# EasyEDA Pro project STM32F722.eprj, board PCB1
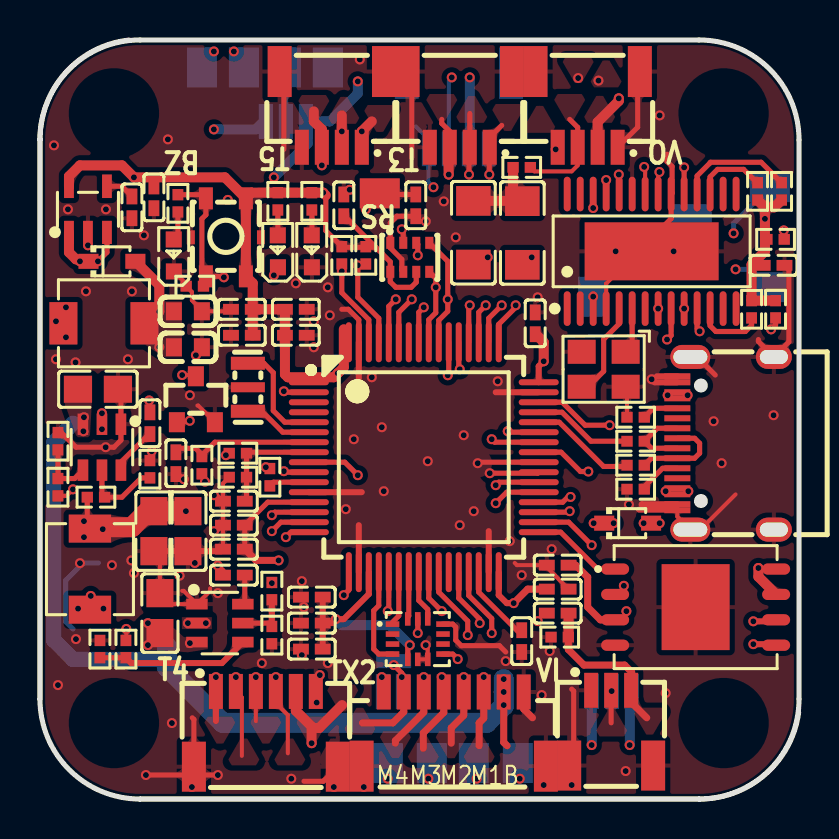
[diagram p1: board, top side]
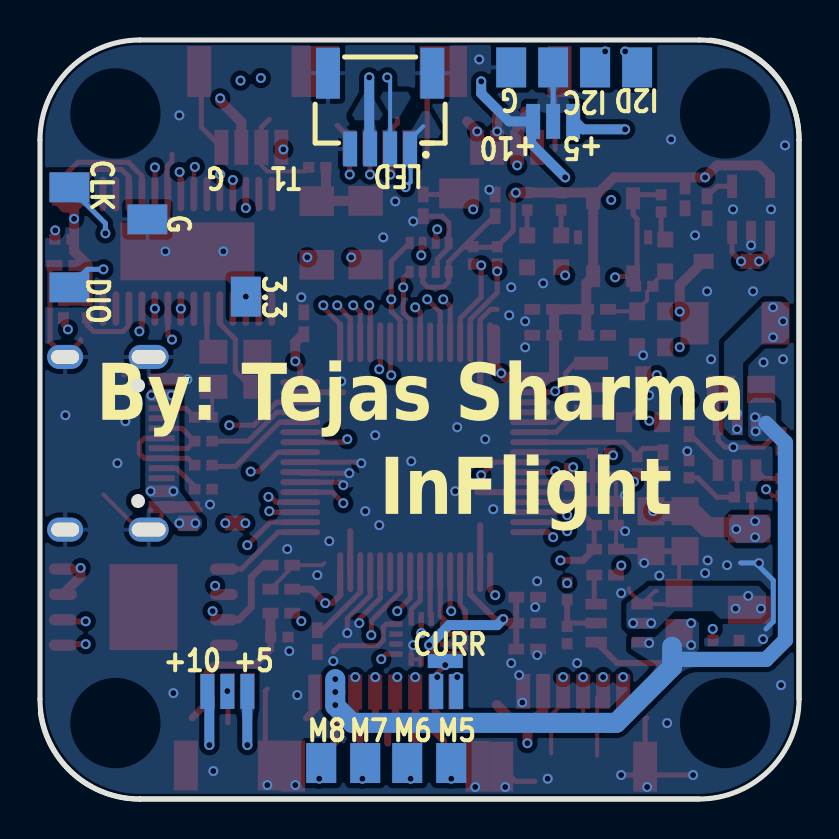
[diagram p2: board, bottom side, seen from below]

Outline 37.97 x 37.97 mm; copper layers: Top Layer, 内层1, MidLayer2, Bottom Layer. Coordinates in mm from the lower left corner of the outline.
Outline path: 4.45,37.97 arc(1.27,36.33) 0,33 0,5 ; 0,5 0,32.97 arc(1.46,36.51) 5,37.97 32.97,37.97 arc(36.51,36.51) 37.97,32.97 37.97,5 arc(36.51,1.46) 32.97,0 5,0 ; 0,5 arc(1.46,1.46) 5,0 ; 5,0 33,0 arc(36.29,1.23) 37.95,4.32
Stack: Top Layer 0.035mm / Dielectric1 1.51mm FR4 er 4.5 / 内层1 0.035mm / Dielectric2 0.48mm PP er 4.5 / MidLayer2 0.035mm / Dielectric3 0.48mm PP er 4.5 / Bottom Layer 0.035mm

## Design rules (mm)
template: 自定义配置
spacing copperThickness1oz (default): track to track 0.102, other pairs 0.152 to 0.3
spacing copperThickness2oz: track to track 0.203, other pairs 0.152 to 0.3
track width copperThickness1oz (default): min 0.127, default 0.254, max 2.54
track width copperThickness2oz: min 0.203, default 0.254, max 2.54
differential pair differentialPair (default): width min 0.127, default 0.254, max 2.54; gap min 0.152, default 0.152
via viaSize (default): diameter min 0.5, default 0.61, max 10; hole min 0.3, default 0.305, max 6.3

## Placement (name value [footprint] x y rotation side)
C13  2.2uF  [C0402]  24.1 7.9 90 top
C14  100nF  [C0402]  6.8 16.8 90 top
C27  1uF  [C0402]  5.7 30.1 90 top
C31  100nF  [C0402]  25.9 9.3 0 top
C33  100nF  [C0402]  12.8 23.2 180 top
C34  10nF  [C0402]  10.1 23.2 0 top
C35  10uF  [C0402]  12.8 24.5 180 top
C37  1uF  [C0402]  10.1 24.5 0 top
C39  100nF  [C0402]  9.7 13.7 0 top
C42  1uF  [C0402]  9.7 12.5 0 top
C43  22uF  [C0805]  6 9.3 90 top
C44  100nF  [C0402]  9.7 11.2 0 top
C51  100nF  [C0402]  5.5 18.8 270 top
C52  22uF  [C0603]  7.4 24.4 180 top
C53  22uF  [C0603]  7.4 22.6 180 top
C54  22uF  [C0805]  2.9 20.5 0 top
C55  22uF  [C0805]  7.4 13.4 90 top
C56  22uF  [C0805]  5.7 13.4 90 top
C57  100nF  [C0402]  13.6 10.1 0 top
C58  100nF  [C0402]  25.9 10.5 180 top
C59  100nF  [C0402]  13.6 7.5 0 top
C60  100nF  [C0402]  24.77 23.8 270 top
C61  100nF  [C0402]  15.2 29.7 270 top
C62  100nF  [C0402]  13.6 8.8 0 top
C63  100nF  [C0402]  25.9 11.7 0 top
C64  100nF  [C0402]  36.7 26.7 180 top
C65  47uF  [C1206]  21.68 28.33 90 top
C66  47uF  [C1206]  24.13 28.32 90 top
C67  100nF  [C0402]  9.7 14.9 0 top
C68  1uF  [C0402]  4.6 29.6 90 top
C69  100nF  [C0402]  18.8 29.7 270 top
CN11  1.0-6PWT  [CONN-SMD_1.0-6PWT]  11.3 3.5 0 top
CN12  HC-1.0-4PWT  [CONN-SMD_4P-P1.00_HCTL_HC-1.0-4PWT]  27.4 34.5 180 top
CN15  HC-1.0-4PWT  [CONN-SMD_4P-P1.00_HCTL_HC-1.0-4PWT]  14.6 34.5 180 top
CN17  HC-1.0-4PWT  [CONN-SMD_4P-P1.00_HCTL_HC-1.0-4PWT]  21 34.5 180 top
CN18  HC-1.0-8PWT  [CONN-SMD_HC-1.0-8PWT]  20.7 3.5 0 top
CN19  1.0-3PWT  [CONN-SMD_1.0-3PWT]  28.57 3.56 0 top
CN21  HC-1.0-4PWT  [CONN-SMD_4P-P1.00_HCTL_HC-1.0-4PWT]  20.96 34.42 0 bottom
D1  1N5819WS  [SOD-323_L1.8-W1.3-LS2.5-RD]  3.6 26.9 0 top
D2  1N5819WS  [SOD-323_L1.8-W1.3-LS2.5-RD]  29.4 13.8 0 top
L2  10uH  [IND-SMD_L4.4-W4.2]  2.5 11.5 270 top
L3  10uH  [IND-SMD_L4.4-W4.2]  3.2 23.8 180 top
LED1  NCD0603B1  [LED0603-RD]  11.9 27.4 90 top
LED3  NCD0603R1  [LED0603-RD_RED]  13.6 27.4 90 top
LED4  NCD0603B1  [LED0603-RD]  6.69 27.19 90 top
NOREF  -  [Pad_e20081]  23.9 1.8 0 top
NOREF#2  -  [Pad_e19975]  19.6 1.8 0 top
NOREF#3  -  [Pad_e19538]  17.15 5.38 0 top
NOREF#4  -  [Pad_e19974]  17.4 1.8 0 top
NOREF#5  -  [Pad_e20483]  36.5 25.6 90 top
NOREF#6  -  [Pad_e20388]  27.68 25.13 180 top
NOREF#7  -  [Pad_e19905]  12.3 36.6 0 top
NOREF#8  -  [Pad_e19811]  17.7 6.9 90 top
NOREF#9  -  [Pad_e19936]  11.3 33.9 0 top
NOREF#10  -  [Pad_e20532]  10.2 36.6 0 top
NOREF#11  -  [Pad_e19906]  14.4 36.6 0 top
NOREF#12  -  [Pad_e19526]  17 30.3 270 top
NOREF#13  -  [Pad_e20121]  29.6 5.38 0 top
NOREF#14  -  [Pad_e20484]  36.5 30.6 90 top
NOREF#15  -  [Pad_e19939]  12.3 33.9 0 top
NOREF#16  -  [Pad_e20122]  28.6 5.38 0 top
NOREF#17  -  [Pad_e20370]  32.6 29 90 top
NOREF#18  -  [Pad_e20531]  8.1 36.6 0 top
NOREF#19  -  [Pad_e19937]  13.3 33.9 0 top
NOREF#20  -  [Pad_e19539]  18.15 5.38 0 top
NOREF#21  -  [Pad_e19976]  21.7 1.8 0 top
NOREF#22  -  [Pad_e20120]  27.6 5.38 0 top
Q1  S8050LT1-J3Y  [SOT-23_L2.9-W1.3-P1.90-LS2.4-BR]  7.8 20 270 top
R14  1kΩ  [R0402]  35.6 24.5 270 top
R24  1kΩ  [R0402]  9.9 16.1 0 top
R25  10kΩ  [R0402]  9.9 17.3 180 top
R26  330Ω  [R0402]  13.6 29.9 270 top
R28  330Ω  [R0402]  11.9 29.9 270 top
R29  330Ω  [R0402]  6.9 29.8 270 top
R30  10kΩ  [R0402]  8.1 16.7 270 top
R31  1kΩ  [R0402]  15.1 27.2 270 top
R32  1kΩ  [R0402]  16.3 27.2 270 top
R33  ICM-42688-P  [LGA-14_L3.0-W2.5-P0.50-TL]  18.9 8 0 top
R34  5.1kΩ  [R0402]  29.8 15.5 0 top
R35  5.1kΩ  [R0402]  29.8 19.1 180 top
R36  22Ω  [R0402]  29.8 16.7 0 top
R37  22Ω  [R0402]  29.8 17.9 0 top
R38  10kΩ  [R0402]  36.8 24.5 270 top
R39  10kΩ  [R0402]  36.8 28 180 top
R40  1kΩ  [R0402]  37.1 30.4 270 top
R41  1kΩ  [R0402]  35.9 30.4 270 top
R43  75Ω  [R0402]  26 8.1 0 top
R44  200kΩ  [R0402]  4.3 7.5 90 top
R45  13.3kΩ  [R0402]  3 7.5 270 top
R48  20kΩ  [R0402]  11.6 8.2 270 top
R49  56kΩ  [R0402]  11.6 10.4 90 top
R50  100kΩ  [R0402]  0.9 15.6 270 top
R51  13.3kΩ  [R0402]  0.9 17.9 270 top
R52  20kΩ  [R0402]  5.5 16.5 90 top
R53  56kΩ  [R0402]  2.8 15.1 180 top
R54  75Ω  [R0402]  24.1 31.6 0 top
R55  1kΩ  [R0402]  11.5 16.1 90 top
R56  10kΩ  [R0402]  7.75 25.65 0 top
U4  STM32F722RET6  [LQFP-64_L10.0-W10.0-P0.50-LS12.0-BL]  19.2 17.1 270 top
U5  BMP280  [LGA-8_L2.5-W2.0-P0.65_AMP6127]  18.5 27.1 90 top
U13  TS3315A 160gf 025  [SW-SMD_4P-L3.4-W3.4-P2.00-LS4.0_TS3315A160GF]  9.3 28.1 90 top
U20  AT7456E  [TSSOP-28_L9.7-W4.4-P0.65-LS6.4-BL-EP-2]  30.6 27.4 0 top
U21  W25N01GVZEIG  [wson-8_l8.0-w6.10-p1.27-bl-ep]  32.8 9.6 270 top
U22  SPX3819M5-L-3-3/TR  [SOT-23-5_L3.0-W1.7-P0.95-LS2.8-BL]  2.4 29.5 0 top
U26  TPS54302DDCR  [SOT-23-6_L2.9-W1.6-P0.95-LS2.8-BL]  9 8.8 270 top
U27  TPS54302DDCR  [SOT-23-6_L2.9-W1.6-P0.95-LS2.8-BL]  3.1 17.6 180 top
USB2  KH-TYPE-C-16P  [USB-C-SMD_KH-TYPE-C-16P]  34.3 17.8 90 top
X1  8MHz  [OSC-SMD_3P-L3.2-W1.3-P1.2-L]  10.4 20.6 270 top
X2  27MHz  [OSC-SMD_4P-L3.2-W2.5-BL]  28.2 21.5 180 top

## Footprints (pads in the part's own frame, mm; a bottom-side part is the same pattern mirrored in y, then rotated)
C0402
  rect 0.79x0.54 smd: 1(-0.545,0) 2(0.545,0)
C0603
  rect 0.8x0.9 smd: 1(-0.7,0) 2(0.7,0)
C0805
  rect 1.41x1.35 smd: 1(-1,0) 2(1,0)
C1206
  rect 1.485x1.728 smd: 1(-1.593,0) 2(1.593,0)
CONN-SMD_1.0-3PWT
  rect 0.7x1.75 smd: 1(-1,1.883) 2(0,1.883) 3(1,1.883)
  rect 1.2x2.5 smd: 4(-2.1,-1.883) 5(2.1,-1.883)
CONN-SMD_1.0-6PWT
  rect 0.7x1.75 smd: 1(-2.5,1.883) 2(-1.5,1.883) 3(-0.5,1.883) 4(0.5,1.883) 5(1.5,1.883) 6(2.5,1.883)
  rect 1.2x2.5 smd: 7(-3.6,-1.883) 8(3.6,-1.883)
CONN-SMD_4P-P1.00_HCTL_HC-1.0-4PWT
  rect 0.7x1.75 smd: 1(-1.5,1.895) 2(-0.5,1.895) 3(0.5,1.895) 4(1.5,1.895)
  rect 1.2x2.55 smd: 5(2.61,-1.895) 6(-2.61,-1.895)
CONN-SMD_HC-1.0-8PWT
  rect 0.7x1.75 smd: 1(-3.5,1.855) 2(-2.5,1.855) 3(-1.5,1.855) 4(-0.5,1.855) 5(0.5,1.855) 6(1.5,1.855) 7(2.499,1.855) 8(3.499,1.855)
  rect 1.2x2.55 smd: 9(4.61,-1.855) 10(-4.61,-1.855)
IND-SMD_L4.4-W4.2
  rect 1.4x2.12 smd: 1(2.028,0) 2(-2.028,0)
LED0603-RD
  rect 0.8x0.8 smd: 1(-0.799,-0.004) 2(0.799,0.004)
LED0603-RD_RED
  rect 0.8x0.8 smd: 1(-0.799,-0.004) 2(0.799,0.004)
LGA-8_L2.5-W2.0-P0.65_AMP6127
  rect 0.6x0.4 smd: 1(0.725,0.975) 2(0.725,0.325) 3(0.725,-0.325) 4(0.725,-0.975) 5(-0.725,-0.975) 6(-0.725,-0.325) 7(-0.725,0.325) 8(-0.725,0.975)
LGA-14_L3.0-W2.5-P0.50-TL
  rect 0.675x0.28 smd: 1(-1.262,0.75) 2(-1.262,0.25) 3(-1.262,-0.25) 4(-1.262,-0.75) 8(1.262,-0.75) 9(1.262,-0.25) 10(1.262,0.25) 11(1.262,0.75)
  rect 0.28x0.675 smd: 5(-0.5,-1.012) 6(0,-1.012) 7(0.5,-1.012) 12(0.5,1.012) 13(0,1.012) 14(-0.5,1.012)
LQFP-64_L10.0-W10.0-P0.50-LS12.0-BL
  oval 0.3x2 smd: 1(-3.75,-5.75) 2(-3.25,-5.75) 3(-2.75,-5.75) 4(-2.25,-5.75) 5(-1.75,-5.75) 6(-1.25,-5.75) 7(-0.75,-5.75) 8(-0.25,-5.75) 9(0.25,-5.75) 10(0.75,-5.75) 11(1.25,-5.75) 12(1.75,-5.75) 13(2.25,-5.75) 14(2.75,-5.75) 15(3.25,-5.75) 16(3.75,-5.75) 33(3.75,5.75) 34(3.25,5.75) 35(2.75,5.75) 36(2.25,5.75) 37(1.75,5.75) 38(1.25,5.75) 39(0.75,5.75) 40(0.25,5.75) 41(-0.25,5.75) 42(-0.75,5.75) 43(-1.25,5.75) 44(-1.75,5.75) 45(-2.25,5.75) 46(-2.75,5.75) 47(-3.25,5.75) 48(-3.75,5.75)
  oval 2x0.3 smd: 17(5.75,-3.75) 18(5.75,-3.25) 19(5.75,-2.75) 20(5.75,-2.25) 21(5.75,-1.75) 22(5.75,-1.25) 23(5.75,-0.75) 24(5.75,-0.25) 25(5.75,0.25) 26(5.75,0.75) 27(5.75,1.25) 28(5.75,1.75) 29(5.75,2.25) 30(5.75,2.75) 31(5.75,3.25) 32(5.75,3.75) 49(-5.75,3.75) 50(-5.75,3.25) 51(-5.75,2.75) 52(-5.75,2.25) 53(-5.75,1.75) 54(-5.75,1.25) 55(-5.75,0.75) 56(-5.75,0.25) 57(-5.75,-0.25) 58(-5.75,-0.75) 59(-5.75,-1.25) 60(-5.75,-1.75) 61(-5.75,-2.25) 62(-5.75,-2.75) 63(-5.75,-3.25) 64(-5.75,-3.75)
OSC-SMD_3P-L3.2-W1.3-P1.2-L
  rect 0.65x1.7 smd: 1(-1.2,0) 3(1.2,0)
  rect 0.5x1.7 smd: 2(0,0)
OSC-SMD_4P-L3.2-W2.5-BL
  rect 1.4x1.2 smd: 1(-1.1,-0.875) 2(1.1,-0.875) 3(1.1,0.875) 4(-1.1,0.875)
Pad_e19526
  rect 1.5x2 smd: 76(0,0)
Pad_e19538
  rect 0.7x1.75 smd far side: 24(0,0)
Pad_e19539
  rect 0.7x1.75 smd far side: 78(0,0)
Pad_e19811
  rect 0.7x1.75 smd far side: 79(0,0)
Pad_e19905
  rect 1.5x2 smd far side: 76(0,0)
Pad_e19906
  rect 1.5x2 smd far side: 76(0,0)
Pad_e19936
  rect 0.7x1.75 smd far side: 70(0,0)
Pad_e19937
  rect 0.7x1.75 smd far side: 70(0,0)
Pad_e19939
  rect 0.7x1.75 smd far side: 70(0,0)
Pad_e19974
  rect 1.5x2 smd far side: 74(0,0)
Pad_e19975
  rect 1.5x2 smd far side: 75(0,0)
Pad_e19976
  rect 1.5x2 smd far side: 76(0,0)
Pad_e20081
  rect 1.5x2 smd far side: 77(0,0)
Pad_e20120
  rect 0.7x1.75 smd far side: 71(0,0)
Pad_e20121
  rect 0.7x1.75 smd far side: 73(0,0)
Pad_e20122
  rect 0.7x1.75 smd far side: 72(0,0)
Pad_e20370
  rect 1.5x2 smd far side: 76(0,0)
Pad_e20388
  rect 1.5x2 smd far side: 76(0,0)
Pad_e20483
  rect 1.5x2 smd far side: 76(0,0)
Pad_e20484
  rect 1.5x2 smd far side: 76(0,0)
Pad_e20531
  rect 1.5x2 smd far side: 76(0,0)
Pad_e20532
  rect 1.5x2 smd far side: 76(0,0)
R0402
  rect 0.566x0.54 smd: 1(-0.433,0) 2(0.433,0)
SOD-323_L1.8-W1.3-LS2.5-RD
  rect 1x0.75 smd: 1(-1.173,0) 2(1.173,0)
SOT-23-5_L3.0-W1.7-P0.95-LS2.8-BL
  rect 0.49x1.157 smd: 1(-0.95,-1.153) 2(0,-1.153) 3(0.95,-1.153)
  rect 0.49x1.175 smd: 4(0.95,1.153) 5(-0.95,1.153)
SOT-23-6_L2.9-W1.6-P0.95-LS2.8-BL
  rect 0.532x1.072 smd: 1(-0.95,-1.149) 2(0,-1.149) 3(0.95,-1.149) 4(0.95,1.149) 5(0,1.149) 6(-0.95,1.149)
SOT-23_L2.9-W1.3-P1.90-LS2.4-BR
  rect 1x0.8 smd: 1(1.15,-0.95) 2(1.15,0.95) 3(-1.15,0)
SW-SMD_4P-L3.4-W3.4-P2.00-LS4.0_TS3315A160GF
  rect 1.1x0.7 smd: 1(-1.95,1) 2(1.95,1) 3(-1.95,-1) 4(1.95,-1)
  rect 0.7x0.4 smd: 5(0,1.755) 5(0,-1.755)
TSSOP-28_L9.7-W4.4-P0.65-LS6.4-BL-EP-2
  oval 0.343x1.732 smd: 1(-4.225,-2.866) 2(-3.575,-2.866) 3(-2.925,-2.866) 4(-2.275,-2.866) 5(-1.625,-2.866) 6(-0.975,-2.866) 7(-0.325,-2.866) 8(0.325,-2.866) 9(0.975,-2.866) 10(1.625,-2.866) 11(2.275,-2.866) 12(2.925,-2.866) 13(3.575,-2.866) 14(4.225,-2.866) 15(4.225,2.866) 16(3.575,2.866) 17(2.925,2.866) 18(2.275,2.866) 19(1.625,2.866) 20(0.975,2.866) 21(0.325,2.866) 22(-0.325,2.866) 23(-0.975,2.866) 24(-1.625,2.866) 25(-2.275,2.866) 26(-2.925,2.866) 27(-3.575,2.866) 28(-4.225,2.866)
  rect 6.7x2.9 smd: 29(0,0)
USB-C-SMD_KH-TYPE-C-16P
  oval 1.2x2 hole 0.7x1.7: 1(-4.32,1.765) 2(4.32,1.765)
  oval 1.2x1.8 hole 0.7x1.4: 3(-4.32,-2.415) 4(4.32,-2.415)
  rect 0.3x1.3 smd: A1(-3.35,2.415) A4(-2.55,2.415) A5(-1.25,2.415) A6(-0.25,2.415) A7(0.25,2.415) A8(1.25,2.415) A9(2.55,2.415) A12(3.35,2.415) B1(3.05,2.415) B4(2.25,2.415) B5(1.75,2.415) B6(0.75,2.415) B7(-0.75,2.415) B8(-1.75,2.415) B9(-2.25,2.415) B12(-3.05,2.415)
wson-8_l8.0-w6.10-p1.27-bl-ep
  oval 0.56x1.4 smd: 1(-1.905,-4.027) 2(-0.635,-4.027) 3(0.635,-4.027) 4(1.905,-4.027) 5(1.905,4.027) 6(0.635,4.027) 7(-0.635,4.027) 8(-1.905,4.027)
  rect 4.3x3.4 smd: 9(0,0)

## Nets
As in the schematic, except:
+3.3V_1: C27.2 C33.2 C34.2 C35.2 C37.2 C39.2 C42.2 C57.2 C58.2 C59.2 C60.2 C61.2 C62.2 C63.2 C64.2 NOREF#6.76 R14.1 R26.1 R28.1 R30.2 R31.1 R32.1 R33.5 R33.8 R38.1 R39.2 R40.2 R41.2 U4.1 U4.13 U4.19 U4.32 U4.48 U4.64 U5.6 U5.8 U13.3 U13.4 U20.3 U20.21 U20.24 U21.3 U21.7 U21.8 U22.5
+5V: CN11.5 CN15.3 CN17.3 CN21.3 D1.1 D2.1 NOREF#9.70 NOREF#22.71 U22.1 U22.3
+10V: C55.2 C56.2 CN12.2 L2.2 NOREF#13.73 NOREF#19.70 R44.2 R53.2
AGND: C13.1 C14.1 C27.1 C33.1 C34.1 C35.1 C37.1 C39.1 C42.1 C43.2 C52.1 C53.1 C54.2 C55.1 C56.1 C57.1 C58.1 C59.1 C60.1 C61.1 C62.1 C63.1 C64.1 C67.1 C68.1 C69.2 CN11.6 CN11.7 CN11.8 CN12.1 CN12.5 CN12.6 CN15.4 CN15.5 CN15.6 CN17.4 CN17.5 CN17.6 CN18.8 CN18.9 CN18.10 CN19.1 CN19.4 CN19.5 CN21.4 CN21.5 CN21.6 LED3.1 LED4.1 NOREF#11.76 NOREF#17.76 Q1.2 R24.1 R33.6 R33.7 R33.11 R34.1 R35.2 R43.1 R45.1 R48.2 R51.1 R52.2 R56.1 U4.12 U4.18 U4.31 U4.47 U4.63 U5.1 U5.7 U13.5 U20.4 U20.20 U20.23 U20.29 U21.4 U21.9 U22.2 U26.1 U27.1 USB2.1 USB2.2 USB2.3 USB2.4 USB2.A1 USB2.A12 USB2.B1 USB2.B12 X1.2 X2.2 X2.4
ADC_CURR: CN18.2 NOREF#8.79 NOREF#20.78 U4.9
I2C_SCL: NOREF#10.76 R32.2 U4.61
I2C_SDA: NOREF#18.76 R31.2 U4.62
MOTOR5: NOREF#4.74 U4.40
MOTOR6: NOREF#2.75 U4.39
MOTOR7: NOREF#21.76 U4.38
MOTOR8: NOREF.77 U4.37
RAM1: CN19.2 NOREF#16.72
RAM5: CN18.1 NOREF#3.24
RAM6: NOREF#7.76 NOREF#15.70
RSSI: C69.1 NOREF#12.76 U4.10
SWCLK: NOREF#14.76 U4.49
SWDIO: NOREF#5.76 U4.46

Pads without a net: R33 2 3 9 10; U4 27 58; U20 1 2 7 13 14 15 16 27 28; USB2 A8 B8

## Via types
v1: diameter 0.5, hole 0.3, Top Layer to Bottom Layer, 238 vias

## Routing (per net, layer and track width the routed paths; a pad name or vN(x,y) marks a point on that pad's centre or on a via; arc(x,y) is an arc through that point)
+3.3V_1: length 188.4
  Top Layer w0.2: v1(28.96,31.24) 28.97,31.22 U20.24 ; v1(30.99,31.37) 30.93,31.31 U20.21 ; v1(8.25,15.88) 8.25,16.11 R30.2
  Top Layer w0.254: U5.6 18.82,25.85 18.57,25.6 17.8,25.6 17.53,25.88 U5.8 17.53,26.88 16.8,27.6 ; 16.8,27.6 15.13,27.6 14.3,28.43 14.3,30.2 ; 16.8,27.6 15.25,29.16 C61.2 ; U4.13 11.4,14.85 C39.2 C42.2 ; v1(18.5,7.7) 18.4,7.6 R33.5 ; v1(20.9,7) 20.65,7.25 R33.8
  Top Layer w0.3: C62.2 C59.2 ; C62.2 C57.2 ; C62.2 14.6,8.8 v1(14.8,9) 15.2,9 16.45,10.25 U4.19 ; v1(25.2,21.9) 24.95,21.65 U4.48 ; v1(23.7,9.8) 23.35,9.8 22.95,10.2 U4.32
  Top Layer w0.35: v1(11.94,11.94) 10.81,11.94 C42.2 ; C63.2 26.8,11.7 27.4,11.1 27.4,9.6 28.03,8.97 29.27,8.97 ; C58.2 24.4,10.5 v1(23.7,9.8)
  Top Layer w0.5: C37.2 C34.2 ; C37.2 10.65,25.81 U13.3 U13.4 ; C37.2 C35.2 C33.2 12.25,21.25 12.4,21.1 14.7,21.1 v1(14.9,21.3) 15.2,21.6 15.2,23.5 ; R38.1 R14.1 35.6,26.73 36.27,27.4 v1(36.27,29.03) 36.27,29.6 ; 36.27,29.6 R41.2 ; 36.27,29.6 36.73,29.6 R40.2 ; U13.4 10.58,30.33 v1(14.17,30.33) 14.3,30.2 ; U13.4 9.25,31.1 v1(4.7,31.1) 4.1,31.7 2,31.7 1.45,31.15 U22.5 ; 24.8,23.25 25.2,22.86 v1(25.2,21.9) ; U21.7 35.94,11.12 v1(35.94,11.56)
  内层1 w0.35: v1(8.25,15.88) 9.4,15.88 10.16,15.11 12.45,15.11 13.46,14.1 13.46,12.7 12.7,11.94 v1(11.94,11.94)
  内层1 w0.5: 29.08,29.08 26.4,26.4 ; 29.08,29.08 30.99,30.99 v1(30.99,31.37) ; 29.08,29.08 29.08,31.11 v1(28.96,31.24) ; 26.4,26.4 26.41,26.4 v1(27.68,25.13) ; 26.4,26.4 18.1,26.4 v1(14.17,30.33) ; v1(29.34,9.4) 29.5,9.4 31.66,11.56 v1(35.94,11.56) ; v1(14.9,21.3) 16.1,20.1 23.4,20.1 v1(25.2,21.9)
  MidLayer2 w0.254: 14.5,16.62 14.08,16.2 14.08,14.08 v1(11.94,11.94)
  MidLayer2 w0.5: v1(18.5,7.7) 18.5,7.3 18.8,7 v1(20.9,7) 22.4,7 23.7,8.3 v1(23.7,9.8) ; v1(14.9,21.3) 14.5,20.9 14.5,9.3 v1(14.8,9) ; v1(35.94,11.56) 35.3,12.2 35.3,25.8 36.27,26.77 v1(36.27,29.03) 35.32,29.97 32.38,29.97 v1(30.99,31.37)
  Bottom Layer w0.5: v1(14.8,9) 15.1,8.7 17.5,8.7 v1(18.5,7.7)
+5V: length 114.3
  Top Layer w0.254: CN17.3 20.5,33.4 20.1,33.8 20.1,34 ; D1.1 v1(2.9,26.9) 3.35,27.35 U22.3
  Top Layer w0.5: v1(20.45,31.24) 20.45,32.55 CN17.3 ; 13.72,3.56 13.97,3.56 15.11,4.7 ; 13.7,34.4 13.7,33.9 14.1,33.5 CN15.3 ; D1.1 2.33,27 1.8,27 1.45,27.35 U22.1 ; CN11.5 12.8,4.42 13.59,3.63 v1(13.59,2.79)
  内层1 w0.5: 23.2,34 23.2,34 v1(20.45,31.24) 19.94,31.75 14.15,31.75 v1(14.1,31.7) 12.3,33.5 v1(8.7,33.5) 8.7,30.3 5.3,26.9 ; 23.2,34 26,34 v1(27.94,35.94) ; 23.2,34 21.5,35.7 v1(21.5,36.1) ; v1(27.6,2.7) 27.6,11.2 28.7,12.3 v1(28.7,13.8) 28.7,17 26.35,19.35 14.35,19.35 6.8,26.9 5.3,26.9 ; 5.3,26.9 v1(2.9,26.9)
  MidLayer2 w0.5: v1(13.59,2.79) 13.68,2.7 v1(27.6,2.7)
  Bottom Layer w0.5: v1(27.6,2.7) 27.6,5.18 ; v1(21.5,36.1) 21.5,32.62 ; v1(8.7,33.5) 10.8,33.5 11.2,33.9
  vias: v1(2,26.9) v1(27.7,13.8)
+10V: length 102.7
  Top Layer w0.2: v1(4.32,8.51) 4.32,7.95 R44.2
  Top Layer w0.254: R53.2 2.37,13.66 L2.2
  Top Layer w0.5: CN12.2 27.9,33.87 28.96,34.92 v1(28.96,35.05)
  Top Layer w1: L2.2 2.57,13.6 4.6,13.6 5.4,14.4 C56.2 C55.2
  内层1 w0.254: v1(4.32,8.51) 4.32,8.62 6.2,10.5 6.2,13.3 v1(7.3,14.4)
  MidLayer2 w0.5: v1(15.9,35.9) 17.1,37.1 28.05,37.1 28.96,36.19 v1(28.96,35.05) ; v1(29.5,2.7) 28.75,1.95 9.95,1.95 5.2,6.7 1.7,6.7 0.8,7.6 0.8,12.5 1.8,13.5 v1(3.14,13.5) 3.58,13.5 8.5,18.42 8.5,27.9 v1(11.7,31.1)
  Bottom Layer w0.5: 29.6,5.18 29.5,5.08 v1(29.5,2.7) ; v1(15.9,35.9) 15.9,35.3 14.5,33.9 13.4,33.9 13.4,32.8 v1(11.7,31.1)
  vias: v1(2.2,13.9) v1(2.2,13.1)
AGND: length 114
  Top Layer w0.2: v1(5.59,17.4) 5.5,17.31 R52.2 ; U26.1 8.51,10.41 8.51,10.54 ; U26.1 7.19,10.41 7.11,10.41 ; U26.1 6.55,9.75 C43.2 6,12.1 C56.1 ; v1(8.7,15.2) 8.85,15.2 C67.1 ; C42.1 C39.1 ; C39.1 8.85,13.4 v1(8.7,13.4) ; C39.1 C67.1 ; U20.4 28.32,25.78 28.32,25.78 29.94,27.4 U20.29 ; LED4.1 7.31,25.78 R56.1 7.6,25.37 7.6,24.95 8.1,24.45 C52.1 9.46,24.4 C37.1 ; R33.6 R33.7 19.4,7.6 v1(19.3,7.7) ; C67.1 9.16,15.79 R24.1 ; Q1.2 7.91,19.69 7.87,19.69 ; C58.1 25.78,11.16 25.78,11.18 25.35,11.6 C63.1 23.86,11.7 23.75,11.81 ; v1(7.2,16) 6.94,16.25 C14.1 ; 31.88,14.75 31.88,14.13 USB2.1 33.04,13.48 34.8,15.24 ; R35.2 29.37,20.56 X2.4
  Top Layer w0.254: U20.29 30.6,28.06 31.57,29.03 U20.20 31.62,30.31 31.62,31.64 31.37,31.9 31.37,32.26 ; 13.21,0.89 14.17,0.89 CN11.8 ; C69.2 17.85,29.16 17.53,28.83 U5.1 17.53,27.58 18.1,27 18.1,26.45 U5.7 ; 35.94,22.99 35.94,22.89 USB2.4 37.47,22.87 37.47,26.48 C64.1 ; C54.2 4.05,20.35 U27.1 4.05,17.95 3.7,17.6 v1(3.29,17.6) 1.8,17.6 1.07,18.33 0.9,18.33 ; CN15.5 12.2,36.18 12.2,32.5 ; CN12.6 29.9,36.28 29.9,33.61 CN12.1 ; CN11.7 7.7,3.98 7.62,4.06 ; 33.78,21.21 32.87,22.12 USB2.2 ; v1(8.9,1.2) v1(5.3,1.2) ; 23.3,7.36 22.98,7.67 21.08,7.67 20.8,7.95 20.8,8.6 20.65,8.75 R33.11 ; 18.6,32.1 18.6,36.18 CN17.5 ; 26.5,1.62 26.7,1.82 26.7,5.4 26.6,5.5 ; 15.1,24.5 15.43,24.5 15.95,23.98 U4.63
  Top Layer w0.3: 31.88,20.85 30.75,20.85 v1(30.6,21) ; 30.1,14.73 30.11,14.75 31.88,14.75 ; C42.1 9.06,12.4 C55.1 C56.1 ; U4.47 22.8,20.35 ; U4.18 15.95,13.7 ; U4.31 22.45,13.4 ; U4.63 15.95,20.6 ; 29.97,14.48 31.85,14.48 31.88,14.45 ; U4.12 16.1,15.35 ; 31.88,21.15 30.86,21.15
  Top Layer w0.35: 24.64,4.06 24.2,4.5 CN18.8
  Bottom Layer w0.254: 1.65,8.51 1.29,8.87 1.29,10.94 2.16,11.81 2.92,11.81
  vias: v1(0.7,32.7) v1(0.8,22) v1(0.9,5.7) v1(1.4,29.5) v1(1.78,21.84) v1(1.8,8) v1(2,11.8) v1(2.3,25.4) v1(2.4,27.7) v1(3.3,29.5) v1(3.6,11.7) v1(4.4,22) v1(4.6,25.4) v1(4.57,11.94) v1(4.7,11.3) v1(5.2,28.2) v1(6.4,33) v1(6.6,3.8) v1(6.99,11.18) v1(7.5,20.2) v1(7.6,0.6) v1(7.75,11.81) v1(7.8,22.2) v1(8.9,10.3) v1(11.1,6.8) v1(12.57,1.02) v1(12.8,25.8) v1(13.1,10.9) v1(13.1,7.2) v1(13.2,9.6) v1(13.7,23.9) v1(13.7,22.6) v1(13.84,4.83) v1(14,6.2) v1(14.4,25.6) v1(14.4,6.8) v1(14.5,24.2) v1(14.7,0.6) v1(15.3,14.5) v1(15.49,30.48) v1(15.7,18) v1(16,37) v1(16.2,0.6) v1(16.6,21.1) v1(17.1,18.6) v1(17.2,15.4) v1(19.3,28.9) v1(19.4,16.9) v1(20.2,29.9) v1(20.8,28.1) v1(21,13.7) v1(21.2,18.2) v1(21.7,14.4) v1(22.9,20.9) v1(23.3,6.9) v1(23.5,12.9) v1(24.1,11.2) v1(24.9,25.1) v1(25.1,5.2) v1(25.2,0.7) v1(25.5,7.4) v1(25.6,12.5) v1(26.6,0.7) v1(28.8,27.4) v1(29.3,1.4) v1(29.46,14.73) v1(31,34.2) v1(31.3,5.3) v1(31.7,27.4) v1(33.7,18.9) v1(34.1,16.8) v1(36.7,19.2)
VBAT: length 53.3
  Top Layer w0.35: v1(23.2,5.36) v1(23.2,4.7) 23.2,2.84 23.37,2.67
  MidLayer2 w0.254: 8.25,7.75 8.55,7.75 v1(11.6,10.8) 10.66,10.8 9.3,12.16 v1(9.3,17.2)
  Bottom Layer w0.762: 1.65,18.8 0.68,17.83 0.68,7.96 1.65,6.99 6.35,6.99
  Bottom Layer w1: v1(23.2,6) v1(23.2,5.36) 23.2,4.66 22.35,3.81 9.14,3.81 6.35,6.6 6.35,7.62
  vias: v1(2.2,19.1) v1(2.17,18.4) v1(5.4,8.8) v1(5.4,7.7) v1(7.5,7.8)
VBUS:
  vias: v1(30.2,13.8) v1(31,13.8) v1(31.3,15.4) v1(31.4,20.2) v1(32.4,20.2) v1(32.44,15.4)
VIN: length 26.4
  Top Layer w0.2: U20.22 30.28,31.57 v1(30.23,31.62)
  MidLayer2 w0.4: v1(24.9,8.9) 24.9,18.3 27.2,20.6 27.2,22.3 30.3,25.4 30.3,31.55 v1(30.23,31.62)
ADC_BATT: length 5.6
  Top Layer w0.254: C67.2 10.33,14.99 R24.2 R25.1 10.38,17.35 U4.8
ADC_CURR: length 17
  Top Layer w0.254: U4.9 15.25,16.85 v1(15.9,16.2) ; v1(18.1,6.1) 18.1,6.3 v1(17.7,6.7)
  Top Layer w0.35: 16.13,3.81 17.65,3.81 18.2,4.36 CN18.2
  MidLayer2 w0.254: v1(17.7,6.7) 15.9,8.5 v1(15.9,16.2)
BARO_CS: length 6.8
  Top Layer w0.254: v1(18.1,28.5) 18.18,28.42 U5.2 ; v1(18.6,25) 17.95,24.35 U4.59
  MidLayer2 w0.254: v1(18.1,28.5) 18.1,27.1 18.6,26.6 v1(18.6,25)
BEEPER: length 2
  Top Layer w0.254: U4.11 11.68,15.85 11.5,15.67
BOOT0: length 17.8
  Top Layer w0.254: R29.1 8.12,30.23 U13.2 8.3,29.23 8.1,29.03 8.1,26.35 U13.1 9.15,26.15 v1(9.2,26.1) ; v1(17.8,25) 17.45,24.65 U4.60
  内层1 w0.254: v1(17.8,25) 10.3,25 v1(9.2,26.1)
FLASH_CS: length 4.6
  Top Layer w0.254: U4.33 26.05,13.35 27.9,11.5 28.8,11.5
GYRO_CS: length 2.4
  Top Layer w0.254: U4.24 18.95,9.94 19.4,9.48 19.4,9.11
GYRO_EXTI1: length 5
  Top Layer w0.254: R33.4 16.95,7.25 16.7,7.5 16.7,9.42 16.95,9.68 U4.20
I2C_SCL: length 18.7
  Top Layer w0.254: U4.61 16.95,24.05 15.9,25.1 v1(15.9,26.7) 16.23,26.7 R32.2
  MidLayer2 w0.254: v1(9.7,37.4) 9.7,36.9 13.5,33.1 13.5,27.9 14.38,27.02 15.58,27.02 v1(15.9,26.7)
I2C_SDA: length 18.5
  Top Layer w0.254: R31.2 v1(15.1,26.4) 15.1,25.33 16.45,23.98 U4.62
  MidLayer2 w0.254: v1(15.1,26.4) 14.5,26.4 13.1,27.8 13.1,32.9 8.7,37.3 v1(8.7,37.4)
LED1: length 7.3
  Top Layer w0.254: U4.2 12.25,20.35 v1(12.2,20.4)
  MidLayer2 w0.254: v1(12.2,20.4) 11.7,20.9 v1(11.7,26.2)
LED_SIRIP: length 18.2
  Top Layer w0.254: v1(23.1,24.7) 22.45,24.05 U4.50
  MidLayer2 w0.254: v1(23.1,24.7) 23.03,24.77 23.03,31.57 20.6,34 v1(20.6,36.1)
  Bottom Layer w0.2: CN21.2 20.46,35.95 v1(20.6,36.1)
LOS: length 3.5
  Top Layer w0.254: U20.12 33.53,23.67 33.81,23.39 35.29,23.39 35.6,23.7 R14.2
MOTOR1: length 8.7
  Top Layer w0.254: U4.29 21.45,10.18 22.6,9.03 v1(22.6,8.3)
  Top Layer w0.35: CN18.6 22.2,4.04 21.97,3.81 21.97,2.67
  内层1 w0.254: v1(22.2,6.1) 22.2,6.2 22.6,6.6 v1(22.6,8.3)
MOTOR2: length 8.8
  Top Layer w0.254: v1(22,8.8) 22,9 20.95,10.05 U4.28
  Top Layer w0.35: 20.57,2.79 20.57,3.56 21.2,4.18 CN18.5
  内层1 w0.254: v1(22,8.8) 22,7.1 21.2,6.3 v1(21.2,6.1)
MOTOR3: length 9.8
  Top Layer w0.254: U4.26 19.95,10.35 21.4,8.9 v1(21.4,8.2)
  Top Layer w0.35: 19.18,2.54 19.18,3.3 20.2,4.33 CN18.4
  内层1 w0.254: v1(20.1,6.1) 20.1,7.2 21.1,8.2 v1(21.4,8.2)
MOTOR4: length 9
  Top Layer w0.254: U4.25 19.45,10.05 v1(20.1,9.4)
  Top Layer w0.35: CN18.3 19.2,4.34 17.78,2.92 17.78,2.79
  内层1 w0.254: v1(19.2,6.1) 19.2,6.85 20.1,7.75 v1(20.1,9.4)
MOTOR5: length 21.8
  Top Layer w0.254: v1(21.9,16.8) 21.95,16.85 U4.40
  内层1 w0.254: v1(17.4,1.02) 17.4,2.41 16.13,3.68 16.13,10.54 21.9,16.31 v1(21.9,16.8)
MOTOR6: length 21.4
  Top Layer w0.254: U4.39 24.9,16.3 v1(22.5,16.3)
  内层1 w0.254: v1(19.43,1.02) 16.57,3.88 16.57,10.22 22.5,16.15 v1(22.5,16.3)
MOTOR7: length 18.7
  Top Layer w0.254: U4.38 22.95,15.85 v1(22.8,15.7)
  内层1 w0.254: v1(21.84,1.02) 21.97,1.02 23.9,2.94 23.9,8.2 22.27,9.83 22.27,15.17 v1(22.8,15.7)
MOTOR8: length 17
  Top Layer w0.254: U4.37 23.35,15.35 v1(22.8,14.8)
  内层1 w0.254: v1(24,1.02) 24,2.41 24.3,2.71 24.3,8.35 22.73,9.92 22.73,14.73 v1(22.8,14.8)
NRST: length 6.9
  Top Layer w0.254: 6.9,17.55 7.79,17.55 8.1,17.23 8.13,17.23 8.75,17.85 U4.7
OSD_CS: length 20
  Top Layer w0.254: U4.41 26.07,17.35 27.04,16.38 v1(27.43,16.38) ; R38.2 36.8,23.72 v1(36.58,23.5)
  内层1 w0.254: v1(30.93,24.53) 31.79,25.4 34.67,25.4 v1(36.58,23.5)
  MidLayer2 w0.254: v1(30.93,24.53) 30.83,24.53 27.9,21.6 27.9,16.85 v1(27.43,16.38)
RAM1: length 1.6
  Top Layer w0.254: 28.57,3.81 28.57,5.38 v1(28.6,5.4)
RAM5:
  vias: v1(17.1,6.1)
RAM6: length 2.7
  Bottom Layer w0.254: NOREF#15.70 NOREF#7.76
RSSI: length 18.1
  Top Layer w0.254: 17,30.1 17.15,30.25 C69.1 ; v1(12.2,16.4) 12.25,16.35 U4.10
  MidLayer2 w0.254: v1(16.3,29.5) 16.5,29.3 16.5,23.7 12.2,19.4 v1(12.2,16.4)
RX1: length 20.7
  Top Layer w0.254: v1(23.4,18.4) 23.45,18.35 U4.43
  MidLayer2 w0.254: v1(26.92,36.07) 26.6,35.74 26.6,21.7 23.4,18.5 v1(23.4,18.4)
RX2: length 10.1
  Top Layer w0.2: 12.4,2.29 12.4,4.2 11.8,4.8 CN11.4
  Top Layer w0.254: U4.17 15.45,10.45 v1(15.2,10.2)
  内层1 w0.254: v1(11.8,6.1) 11.8,6.75 15.2,10.15 v1(15.2,10.2)
RX3: length 11.5
  Top Layer w0.254: U4.52 21.45,24.65 v1(21.5,24.7) ; v1(21.46,31.24) 21.46,32.57 CN17.2 21.5,34.3
  MidLayer2 w0.254: v1(21.46,31.24) 21.46,24.74 v1(21.5,24.7)
RX4: length 13.4
  Top Layer w0.2: 10.1,2.16 10.1,5.08 CN11.2
  Top Layer w0.254: U4.15 12.05,13.85 v1(11.6,13.4)
  内层1 w0.254: v1(11.6,13.4) 10.04,11.84 10.04,6.34 v1(9.8,6.1)
RX5: length 18.4
  Top Layer w0.254: U4.54 20.45,21.25 v1(20.4,21.2)
  Top Layer w0.5: 15.1,34.2 v1(15.1,33.4) CN15.2
  MidLayer2 w0.254: v1(15.1,33.4) 15.24,33.4 16.9,31.74 16.9,23.56 19.26,21.2 v1(20.4,21.2)
SAG: length 7.5
  内层1 w0.5: v1(28.32,30.97) 27.54,30.97 23.68,27.1 v1(22.4,27.1)
SPI_MISO1: length 2.6
  Top Layer w0.254: 17.64,8.85 17.95,9.16 U4.22
SPI_MISO2: length 7
  Top Layer w0.254: v1(26.5,14.4) 26.45,14.35 U4.35
  MidLayer2 w0.254: v1(26.5,14.4) 26.5,12.36 28.19,10.67 v1(29.21,10.67)
SPI_MISO3: length 19.7
  Top Layer w0.254: v1(33,23.4) 32.88,23.53 U20.11 ; U4.56 19.45,23.98 19.8,24.33 v1(19.8,25.6) 19.8,26.05 U5.5
  内层1 w0.254: v1(33,23.4) 32.8,23.6 20.7,23.6 19.8,24.5 v1(19.8,25.6)
SPI_MOSI1: length 2.3
  Top Layer w0.254: 18.4,9.11 18.45,9.16 U4.23
SPI_MOSI2: length 16.8
  Top Layer w0.254: U4.36 26.15,14.85 26.41,15.11 v1(26.54,15.11)
  Top Layer w0.3: v1(35.69,7.75) 36.78,7.75 U21.5
  MidLayer2 w0.254: v1(35.69,7.75) 35.05,8.38 35.05,9.27 32.26,12.06 27.43,12.06 27.03,12.47 27.03,14.63 v1(26.54,15.11)
SPI_MOSI3: length 19.8
  Top Layer w0.254: v1(18.9,27.2) 18.9,27.75 U5.3 ; v1(19.2,24.6) 18.95,24.35 U4.57 ; U20.9 31.57,23.19 v1(31.37,22.99)
  内层1 w0.254: v1(19.2,24.6) 19.2,24.37 20.47,23.1 31.26,23.1 v1(31.37,22.99)
  MidLayer2 w0.254: v1(18.9,27.2) 19.2,26.9 v1(19.2,24.6)
SPI_SCK1: length 4.7
  Top Layer w0.254: v1(18.9,8.3) 18.9,9.11 ; U4.21 17.45,9.45 v1(17.4,9.4)
  内层1 w0.254: v1(18.9,8.3) 18.5,8.3 v1(17.4,9.4)
SPI_SCK2: length 14.2
  Top Layer w0.254: U4.34 26.45,13.85 v1(27.6,12.7)
  Top Layer w0.3: v1(35.69,8.89) 36.75,8.89 U21.6
  MidLayer2 w0.254: v1(27.6,12.7) 27.69,12.7 27.94,12.45 32.55,12.45 35.69,9.31 v1(35.69,8.89)
SPI_SCK3: length 18.2
  Top Layer w0.254: U5.4 20.4,26.9 v1(20.4,25) 20.4,24.4 19.95,23.95 U4.55
  内层1 w0.254: 32.1,24.5 31.6,24 20.84,24 20.4,24.44 v1(20.4,25)
  vias: v1(32.22,24.53)
SWCLK: length 17.9
  Top Layer w0.254: U4.49 22.95,23.75 23.8,24.6 v1(23.8,24.7)
  内层1 w0.254: v1(23.8,24.7) 24.1,24.4 29.9,24.4 33.8,28.3 v1(34.7,28.3)
  Bottom Layer w0.254: NOREF#14.76 34.7,28.8 v1(34.7,28.3)
SWDIO: length 18.7
  Top Layer w0.254: U4.46 26.12,19.85 27.27,18.7 v1(28.5,18.7)
  MidLayer2 w0.254: v1(28.5,18.7) 32.2,18.7 34,20.5 34,25.7 v1(34.8,26.5)
  Bottom Layer w0.254: NOREF#5.76 35.6,26.5 v1(34.8,26.5)
TX1: length 18.6
  Top Layer w0.254: U4.42 22.75,17.85 v1(22.6,18)
  MidLayer2 w0.254: v1(22.6,18) 22.6,18.36 26.2,21.96 26.2,32.1 v1(25.8,32.5)
TX2: length 10.6
  Top Layer w0.2: CN11.3 10.8,3.9
  Top Layer w0.254: U4.16 12.55,13.35 v1(12.3,13.1)
  内层1 w0.254: v1(12.3,13.1) 10.5,11.3 10.5,6.4 v1(10.8,6.1)
TX3: length 11.8
  Top Layer w0.254: v1(22.48,31.24) 22.48,33.08 23.1,33.7 ; v1(22.3,24.7) 21.95,24.35 U4.51
  MidLayer2 w0.254: v1(22.48,31.24) 22.34,31.24 21.87,30.77 21.87,25.13 v1(22.3,24.7)
TX4: length 12.7
  Top Layer w0.254: v1(11.6,14.2) 11.75,14.35 U4.14
  Top Layer w0.3: CN11.1 8.8,3.9
  内层1 w0.254: v1(8.8,6.1) 9.6,6.9 9.6,12.15 11.6,14.15 v1(11.6,14.2)
TX5: length 17.7
  Top Layer w0.254: U4.53 20.95,21.55 v1(21,21.5)
  Top Layer w0.5: 16.6,33.9 v1(16.1,33.4) CN15.1
  MidLayer2 w0.254: v1(16.1,33.4) 16.1,33.04 17.27,31.87 17.27,23.69 19.21,21.75 20.75,21.75 v1(21,21.5)
USB_DM: length 5.4
  Top Layer w0.254: R36.1 29.3,16.64 28.19,16.64 25.98,18.85 U4.44
USB_DP: length 5
  Top Layer w0.254: R37.1 27.57,17.9 26.12,19.35 U4.45
VOUT: length 4.1
  内层1 w0.5: v1(27.68,29.57) 27.07,29.57 v1(24.6,27.1)
$1N5315: length 4.2
  Top Layer w0.254: 24.1,8.44 24.1,8.3 24.05,8.25 21.95,10.35 U4.30
$1N6274: length 1.3
  Top Layer w0.254: 13.6,28.15 13.6,29.46 R26.2
$1N6277: length 1.3
  Top Layer w0.254: 11.91,28.15 11.9,28.15 R28.2
$1N6597: length 1.6
  Top Layer w0.254: 6.9,29.37 6.9,27.99 LED4.2
$1N6740: length 5.6
  Top Layer w0.254: U4.5 12.25,18.85 11.67,19.43 11.67,21.33 11.2,21.8 10.2,21.8
$1N6754: length 3.7
  Top Layer w0.254: U4.6 12.15,18.35 11.1,19.4 10.2,19.4
$1N8449: length 1.8
  Top Layer w0.254: R35.1 30.68,19.55 31.88,19.55
$1N8452: length 2.2
  Top Layer w0.254: 31.88,16.55 31.15,16.55 30.23,15.63 R34.2
$1N8750: length 4.7
  Top Layer w0.254: R36.2 30.58,17.05 32.75,17.05 33,17.3 33,17.8 32.75,18.05 31.88,18.05
$1N8765: length 3.7
  Top Layer w0.254: 31.88,18.55 30.88,18.55 R37.2 30.59,17.55 31.88,17.55
$1N15437: length 2.1
  Top Layer w0.254: U20.6 29.62,22.9 29.3,22.58
$1N15438: length 4.9
  Top Layer w0.254: X2.3 27.43,20.62 28.2,21.4 28.2,23 28.97,23.78 U20.5
$1N15463: length 8.1
  Top Layer w0.2: v1(37.21,28.45) 37.23,28.43 R39.1
  Top Layer w0.254: U20.19 v1(32.22,31.6)
  内层1 w0.254: v1(32.22,31.6) 32.6,31.6 35.75,28.45 v1(37.21,28.45)
$1N15464: length 3.7
  Top Layer w0.254: 35.9,30.83 35.87,30.83 35.2,31.5 33.9,31.5 33.53,31.12 U20.17
$1N15465: length 5.8
  Top Layer w0.254: U20.18 32.88,31.17 33.5,31.8 33.54,31.86 36.08,31.86 37.1,30.83
$1N15786: length 8.1
  Top Layer w0.35: 30.35,4.06 29.6,4.82 29.6,6.35 29.25,6.7 27.21,6.7 26.43,7.48 R43.2
  Top Layer w0.5: R43.2 26.44,8.11 C31.2
$1N34361: length 4.1
  Top Layer w0.254: C44.1 9.16,11.42 v1(8.89,11.68)
  MidLayer2 w0.254: v1(8.89,11.68) 7.4,10.19 v1(7.4,8.8)
  vias: v1(1.91,9.53) v1(2.54,10.16) v1(3.18,9.53) v1(8.3,8.8)
$1N34362: length 1.5
  Top Layer w0.254: C44.2 10.25,9.85 U26.6
$1N34400: length 7.7
  Top Layer w0.254: R45.2 R44.1
  Top Layer w0.3: R44.1 4.57,6.8 9.1,6.8 10.15,7.85
$1N34492: length 2.9
  Top Layer w0.254: 11.6,8.63 11.43,8.8 U26.5
  Top Layer w0.3: 11.6,8.63 R49.1
$1N34966: length 13.6
  Top Layer w0.2: 0.9,15.17 1.32,15.17 v1(1.65,15.49)
  Top Layer w0.5: v1(5.97,24.38) 5.97,25.7 D1.2
  内层1 w0.254: v1(1.65,15.49) 2.89,15.49 6.1,18.7 6.1,22.48 v1(5.97,22.61)
$1N34973: length 3.2
  Top Layer w0.2: v1(5.46,19.94) 5.5,19.9 C51.1
  MidLayer2 w0.254: v1(3.1,19.3) 3.1,19.3 4.83,19.3 v1(5.46,19.94)
  vias: v1(0.8,23.9) v1(1.3,24.6) v1(1.3,23.1) v1(3.1,18.5)
$1N34978: length 2.4
  Top Layer w0.254: U27.6 4.05,16.85 5.46,18.25
$1N34984: length 2.9
  Top Layer w0.254: U27.4 1.73,16.03 R50.1 R51.2
$1N34994: length 4.1
  Top Layer w0.254: R52.1 5.07,16.07 4.1,15.1 R53.1 3.1,15.23 U27.5
$1N42503: length 4.3
  Top Layer w0.5: 24.12,29.92 23.67,30.37 R54.1 ; 24.12,29.92 C66.2 ; 24.12,29.92 C65.2
$1N42504: length 5
  Top Layer w0.2: R54.2 24.73,31.4 26.6,31.4 26.9,31.7 CN12.3
  Top Layer w0.254: 26.5,34 26.9,33.6 CN12.3
$1N48463: length 1.5
  Top Layer w0.254: U22.4 4.09,30.65 C68.2
$1N67638: length 5.4
  Top Layer w0.2: Q1.1 7.42,18.85 v1(7.49,18.92)
  内层1 w0.254: v1(11.3,16.6) 8.98,18.92 v1(7.49,18.92)
$1N67645: length 24.7
  Top Layer w0.2: v1(7.11,21.21) 7.74,21.21 Q1.3
  内层1 w0.2: v1(19.69,30.61) 19.3,30.99 13.34,30.99 12.32,29.97 v1(9.4,29.97)
  MidLayer2 w0.254: v1(9.4,29.97) 9.4,29.8 7.2,27.6 7.2,21.3 v1(7.11,21.21)
  Bottom Layer w0.2: 19.43,32.5 19.43,33.02 18.8,33.66 ; 19.43,32.5 19.43,30.86 v1(19.69,30.61) ; 19.43,32.5 CN21.1

## Copper pours and planes (outline as drawn; the poured copper is in the pictures)
+5V on Top Layer: 12.93,35.22 14.47,35.22 14.47,33.87 12.93,33.87
+5V on Top Layer: 14.37,5.73 15.92,5.73 15.92,4.38 14.37,4.38
+5V on Top Layer: 27.55,36.95 29.09,36.95 29.09,35.6 27.55,35.6
+5V on Top Layer: 12.83,4.12 14.37,4.12 14.37,2.77 12.83,2.77
+5V on Top Layer: 19.33,35.27 20.87,35.27 20.87,33.92 19.33,33.92
+5V on Bottom Layer: 20.82,35.3 22.36,35.3 22.36,33.95 20.82,33.95
+5V on 内层1: 27.6,14.3 28.8,14.3 28.8,13.4 27.6,13.4
+10V on Top Layer: 27.23,35.18 28.77,35.18 28.77,33.83 27.23,33.83
+10V on Bottom Layer: 1.4,14.22 3.5,14.22 3.5,12.8 1.4,12.8
+10V on MidLayer2: 1.4,14.2 3.5,14.2 3.5,12.8 1.4,12.8
AGND on Top Layer: 11.43,34.63 12.97,34.63 12.97,33.28 11.43,33.28
AGND on Top Layer: 13.93,3.03 15.47,3.03 15.47,1.68 13.93,1.68
AGND on Top Layer: 29.51,34.77 31.05,34.77 31.05,33.42 29.51,33.42
AGND on Top Layer: 0.25,33.07 0.27,33.5 0.33,33.92 0.43,34.34 0.57,34.75 0.74,35.14 0.95,35.52 1.19,35.87 1.47,36.2 1.77,36.51 2.1,36.78 2.46,37.02 2.83,37.23 3.22,37.4 3.63,37.54 4.05,37.64 4.47,37.7 4.9,37.72 33.07,37.72 33.5,37.7 33.92,37.64 34.34,37.54 34.75,37.4 35.14,37.23 35.52,37.02 35.87,36.78 36.2,36.51 36.51,36.2 36.78,35.87 37.02,35.52 37.23,35.14 37.4,34.75 37.54,34.34 37.64,33.92 37.7,33.5 37.72,33.07 37.72,4.9 37.7,4.47 37.64,4.05 37.54,3.63 37.4,3.22 37.23,2.83 37.02,2.46 36.78,2.1 36.51,1.77 36.2,1.47 35.87,1.19 35.52,0.95 35.14,0.74 34.75,0.57 34.34,0.43 33.92,0.33 33.5,0.27 33.07,0.25 4.9,0.25 4.47,0.27 4.05,0.33 3.63,0.43 3.22,0.57 2.83,0.74 2.46,0.95 2.1,1.19 1.77,1.47 1.47,1.77 1.19,2.1 0.95,2.46 0.74,2.83 0.57,3.22 0.43,3.63 0.33,4.05 0.27,4.47 0.25,4.9
AGND on Top Layer: 17.83,34.68 19.37,34.68 19.37,33.33 17.83,33.33
AGND on Top Layer: 26.02,4.53 27.57,4.53 27.57,3.18 26.02,3.18
AGND on Bottom Layer: 0.25,33.07 0.27,33.5 0.33,33.92 0.43,34.34 0.57,34.75 0.74,35.14 0.95,35.52 1.19,35.87 1.47,36.2 1.77,36.51 2.1,36.78 2.46,37.02 2.83,37.23 3.22,37.4 3.63,37.54 4.05,37.64 4.47,37.7 4.9,37.72 33.07,37.72 33.5,37.7 33.92,37.64 34.34,37.54 34.75,37.4 35.14,37.23 35.52,37.02 35.87,36.78 36.2,36.51 36.51,36.2 36.78,35.87 37.02,35.52 37.23,35.14 37.4,34.75 37.54,34.34 37.64,33.92 37.7,33.5 37.72,33.07 37.72,4.9 37.7,4.47 37.64,4.05 37.54,3.63 37.4,3.22 37.23,2.83 37.02,2.46 36.78,2.1 36.51,1.77 36.2,1.47 35.87,1.19 35.52,0.95 35.14,0.74 34.75,0.57 34.34,0.43 33.92,0.33 33.5,0.27 33.07,0.25 4.9,0.25 4.47,0.27 4.05,0.33 3.63,0.43 3.22,0.57 2.83,0.74 2.46,0.95 2.1,1.19 1.77,1.47 1.47,1.77 1.19,2.1 0.95,2.46 0.74,2.83 0.57,3.22 0.43,3.63 0.33,4.05 0.27,4.47 0.25,4.9
AGND on Bottom Layer: 22.47,34.41 24.01,34.41 24.01,33.06 22.47,33.06
VBAT on Top Layer: 1.2,19.9 2.6,19.9 2.6,18.1 1.2,18.1
VBAT on Top Layer: 5,9 8.4,9 8.4,7.34 5,7.34
VBAT on Bottom Layer: 22.73,6.35 23.62,6.35 23.62,4.32 22.73,4.32
VBAT on Bottom Layer: 1.14,20.07 2.54,20.07 2.54,17.91 1.14,17.91
VBAT on Bottom Layer: 5,9 8.4,9 8.4,6.6 5,6.6
VBAT on MidLayer2: 5,9 8.5,9 8.5,7.4 5,7.4
VBAT on MidLayer2: 22.7,6.3 23.6,6.3 23.6,4.4 22.7,4.4
VBUS on Bottom Layer: 29.87,15.7 32.6,15.7 32.6,13.4 29.87,13.4
VBUS on Bottom Layer: 31,20.5 32.7,20.5 32.7,15.1 31,15.1
ADC_CURR on Top Layer: 15.23,4.56 16.78,4.56 16.78,3.22 15.23,3.22
LED_SIRIP on Bottom Layer: 19.42,35.39 20.97,35.39 20.97,34.04 19.42,34.04
MOTOR1 on Top Layer: 21.2,3.17 22.74,3.17 22.74,1.82 21.2,1.82
MOTOR2 on Top Layer: 19.8,3.39 21.35,3.39 21.35,2.04 19.8,2.04
MOTOR3 on Top Layer: 18.4,3.17 19.95,3.17 19.95,1.82 18.4,1.82
MOTOR4 on Top Layer: 17.01,3.39 18.55,3.39 18.55,2.04 17.01,2.04
RAM1 on Top Layer: 27.83,4.48 29.37,4.48 29.37,3.13 27.83,3.13
RX1 on Top Layer: 26.15,37.17 27.7,37.17 27.7,35.82 26.15,35.82
RX2 on Top Layer: 11.73,3.03 13.27,3.03 13.27,1.68 11.73,1.68
RX3 on Top Layer: 20.83,35.18 22.37,35.18 22.37,33.83 20.83,33.83
RX4 on Top Layer: 9.43,3.03 10.97,3.03 10.97,1.68 9.43,1.68
RX5 on Top Layer: 14.43,35.13 15.97,35.13 15.97,33.78 14.43,33.78
TX1 on Top Layer: 24.23,34.68 25.77,34.68 25.77,33.33 24.23,33.33
TX2 on Top Layer: 10.53,4.12 12.07,4.12 12.07,2.77 10.53,2.77
TX3 on Top Layer: 22.63,34.77 24.17,34.77 24.17,33.42 22.63,33.42
TX4 on Top Layer: 8.23,4.12 9.77,4.12 9.77,2.77 8.23,2.77
TX5 on Top Layer: 16.23,34.72 17.77,34.72 17.77,33.37 16.23,33.37
$1N15786 on Top Layer: 29.73,4.57 31.27,4.57 31.27,3.22 29.73,3.22
$1N34361 on Bottom Layer: 6.22,10.48 8.64,10.48 8.64,8.51 6.22,8.51
$1N34361 on Bottom Layer: 1.65,10.67 8,10.67 8,9.02 1.65,9.02
$1N34361 on MidLayer2: 6.99,9.14 8.64,9.14 8.64,8.51 6.99,8.51
$1N34966 on Top Layer: 5.1,24.9 7.1,24.9 7.1,22.1 5.1,22.1
$1N34973 on Bottom Layer: 0.5,24.9 3.75,24.9 3.75,18.2 0.5,18.2
$1N42504 on Top Layer: 25.73,35.27 27.27,35.27 27.27,33.92 25.73,33.92
$1N67645 on Bottom Layer: 17.9,34.41 19.44,34.41 19.44,33.06 17.9,33.06

Small or netless copper shapes (teardrops, artwork), in the pictures only: 386 on Top Layer, 18 on Bottom Layer, 58 on 内层1, 50 on MidLayer2

## Text on the board
Bottom Silkscreen Layer: M5 | CURR | M6 | M7 | M8 | +5 | +10 | CLK | DIO | I2D | I2C | G | LED | T1 | 3.3 | By: Tejas Sharma / InFlight
Top Silkscreen Layer: M1 | B | M4 | M3 | M2 | T4 | TX2 | VI | BZ | T5 | RS | T3 | VO
